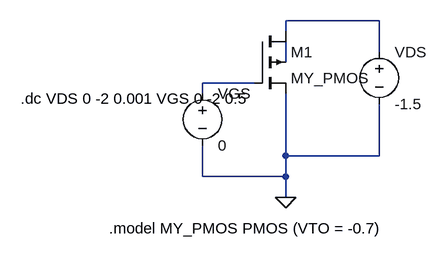
[diagram p0: schematic pmos_iv.asc]
pmos_iv.asc, the LTspice schematic file:
Version 4.1
SHEET 1 880 680
WIRE 336 80 192 80
WIRE 192 96 192 80
WIRE 336 128 336 80
WIRE 192 144 192 112
WIRE 144 176 64 176
WIRE 64 192 64 176
WIRE 192 288 192 192
WIRE 336 288 336 208
WIRE 336 288 192 288
WIRE 64 320 64 272
WIRE 192 320 192 288
WIRE 192 320 64 320
WIRE 192 352 192 320
FLAG 192 352 0
SYMBOL pmos4 144 96 R0
SYMATTR InstName M1
SYMATTR Value MY_PMOS
SYMBOL voltage 64 176 R0
WINDOW 123 0 0 Left 0
WINDOW 39 0 0 Left 0
SYMATTR InstName VGS
SYMATTR Value 0
SYMBOL voltage 336 112 R0
WINDOW 123 0 0 Left 0
WINDOW 39 0 0 Left 0
SYMATTR InstName VDS
SYMATTR Value -1.5
TEXT -80 400 Left 2 !.model MY_PMOS PMOS (VTO = -0.7)
TEXT -216 200 Left 2 !.dc VDS 0 -2 0.001 VGS 0 -2 0.5

The netlist it stands for:
* pmos_iv.asc
M1 N001 N003 0 N002 MY_PMOS
VGS N003 0 0
VDS N001 0 -1.5
.model NMOS NMOS
.model PMOS PMOS
.lib standard.mos
.model MY_PMOS PMOS (VTO = -0.7)
.dc VDS 0 -2 0.001 VGS 0 -2 0.5
.backanno
.end